# EAGLE design schematics (EAGLE 7.4.0)
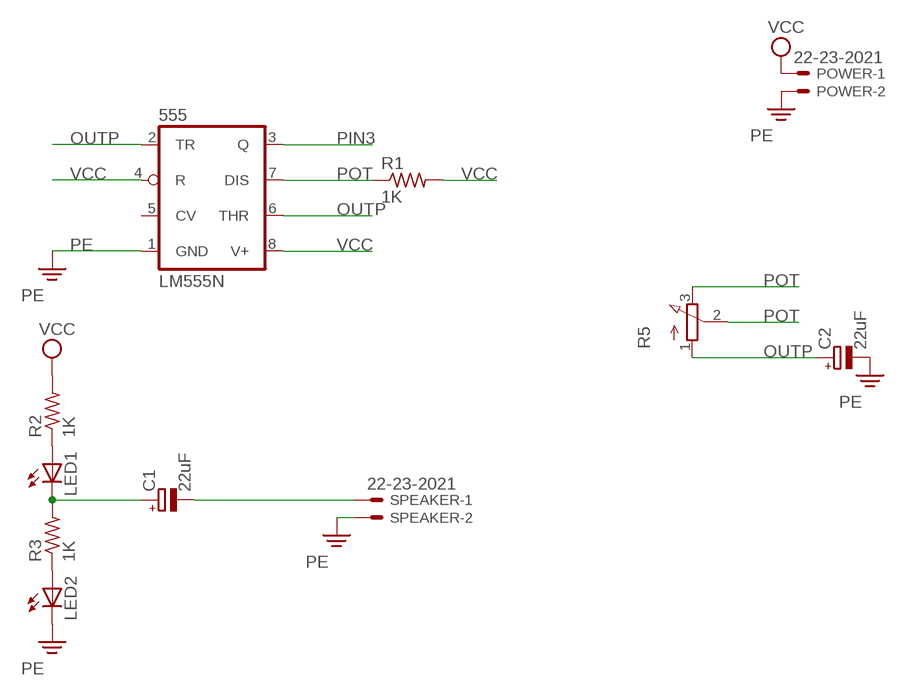
[diagram p0: schematic, sheet 1]

## Parts
555  LM555N  [DIL08]
C1  22uF  CPOL-EUE2.5-7  [E2,5-7]
C2  22uF  CPOL-EUE2.5-7  [E2,5-7]
LED1  LED5MM  [LED5MM]
LED2  LED5MM  [LED5MM]
POWER  22-23-2021  [22-23-2021]
R1  1K  R-US_0207/10  [0207/10]
R2  1K  R-US_0207/10  [0207/10]
R3  1K  R-US_0207/10  [0207/10]
R5  3RP/1610N  [3RP/1610N]
SPEAKER  22-23-2021  [22-23-2021]

## Nets
N$1: LED1.A R2.1
N$4: LED2.A R3.1
N$5: C1.- SPEAKER.1
OUTP: 555.2(TR) 555.6(THR) C2.+ R5.1(A)
PE: 555.1(GND) C2.- LED2.K(C) POWER.2 SPEAKER.2
PIN3: 555.3(Q) C1.+ LED1.K(C) R3.2
POT: 555.7(DIS) R1.1 R5.2(S) R5.3(E)
VCC: 555.4(R) 555.8(V+) POWER.1 R1.2 R2.2
Unconnected: 555.5(CV)

## Library data of the parts
555 = linear:*555: TIMER
C1 C2 = resistor:CPOL-EU: POLARIZED CAPACITOR, European symbol
LED1 LED2 = adafruit:LED: LED OSRAM: - CHIPLED LG R971, LG N971, LY N971, LG Q971, LY Q971, LO R971, LY R971 LH N974, LH R974 LS Q976, LO Q976, LY Q976 LO Q996 - Hyper CHIPLED LW Q18S LB Q993, LB Q99A, LB R99A - SideLED LS A670, LO A670, LY A670, LG A670, LP A670 LB A673, LV A673, LT A673, LW A673 LH A674 LY A675 LS A676, LA A676, LO A676, LY A676, LW A676 LS A679, LY A679, LG A679 - Hyper Micro SIDELED® LS Y876, LA Y876, LO Y876, LY Y876 LT Y87S - SmartLED LW L88C, LW L88S LB L89C, LB L89S, LG L890 LS L89K, LO L89K, LY L89K LS L896, LA L896, LO L896, LY L896 - TOPLED LS T670, LO T670, LY T670, LG T670, LP T670 LSG T670, LSP T670, LSY T670, LOP T670, LYG T670 LG T671, LOG T671, LSG T671 LB T673, LV T673, LT T673, LW T673 LH T674 LS T676, LA T676, LO T676, LY T676, LB T676, LH T676, LSB T676, LW T676 LB T67C, LV T67C, LT T67C, LS T67K, LO T67K, LY T67K, LW E67C LS E67B, LA E67B, LO E67B, LY E67B, LB E67C, LV E67C, LT E67C LW T67C LS T679, LY T679, LG T679 LS T770, LO T770, LY T770, LG T770, LP T770 LB T773, LV T773, LT T773, LW T773 LH T774 LS E675, LA E675, LY E675, LS T675 LS T776, LA T776, LO T776, LY T776, LB T776 LHGB T686 LT T68C, LB T68C - Hyper Mini TOPLED® LB M676 - Mini TOPLED Santana® LG M470 LS M47K, LO M47K, LY M47K Source: http://www.osram.convergy.de/
POWER SPEAKER = con-molex:22-23-2021: .100" (2.54mm) Center Header - 2 Pin; MF: MOLEX; MPN: 22-23-2021; OC_FARNELL: 1462926; OC_NEWARK: 25C3832
R1-R3 = adafruit:R-US_: RESISTOR, American symbol
R5 = pot:3RP/1610N: 16mm Potentiometer one level Source: http://www.alphapotentiometers.net/html/16mm_pot_2.html

## Board
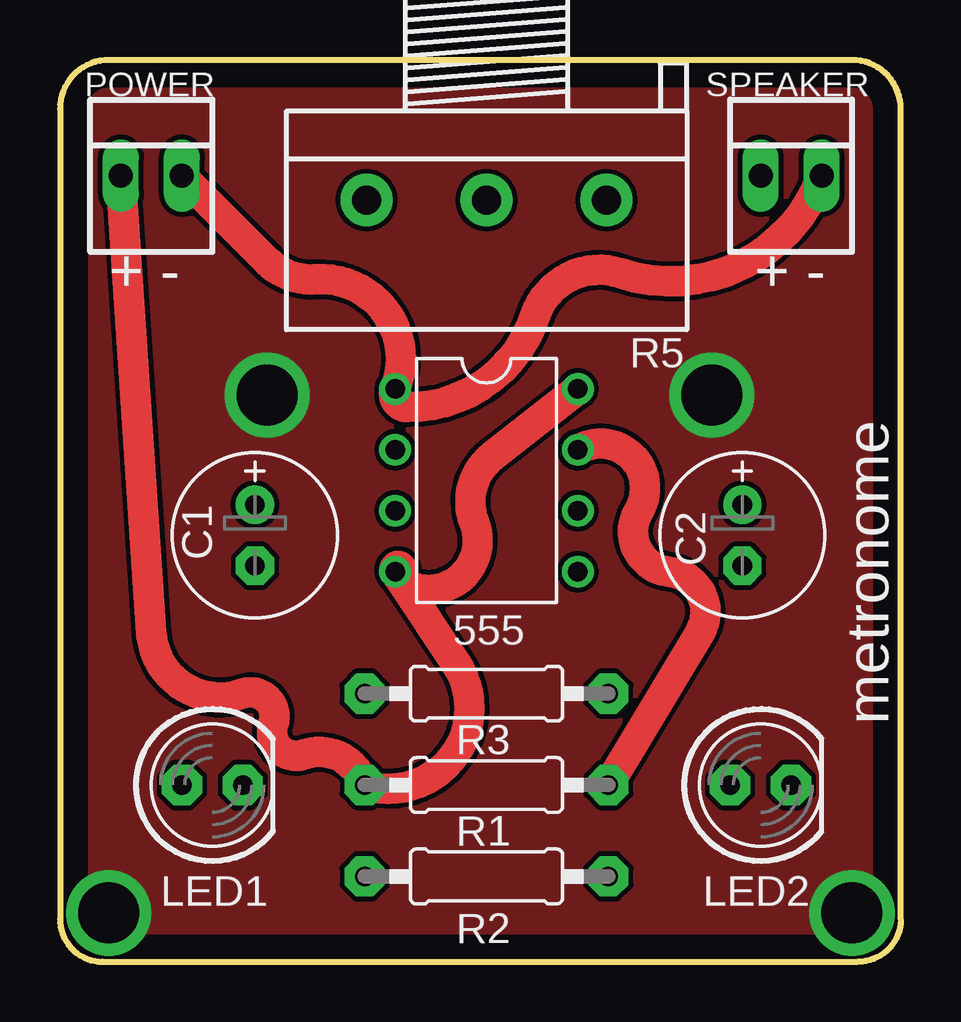
[diagram p1: board, top side]
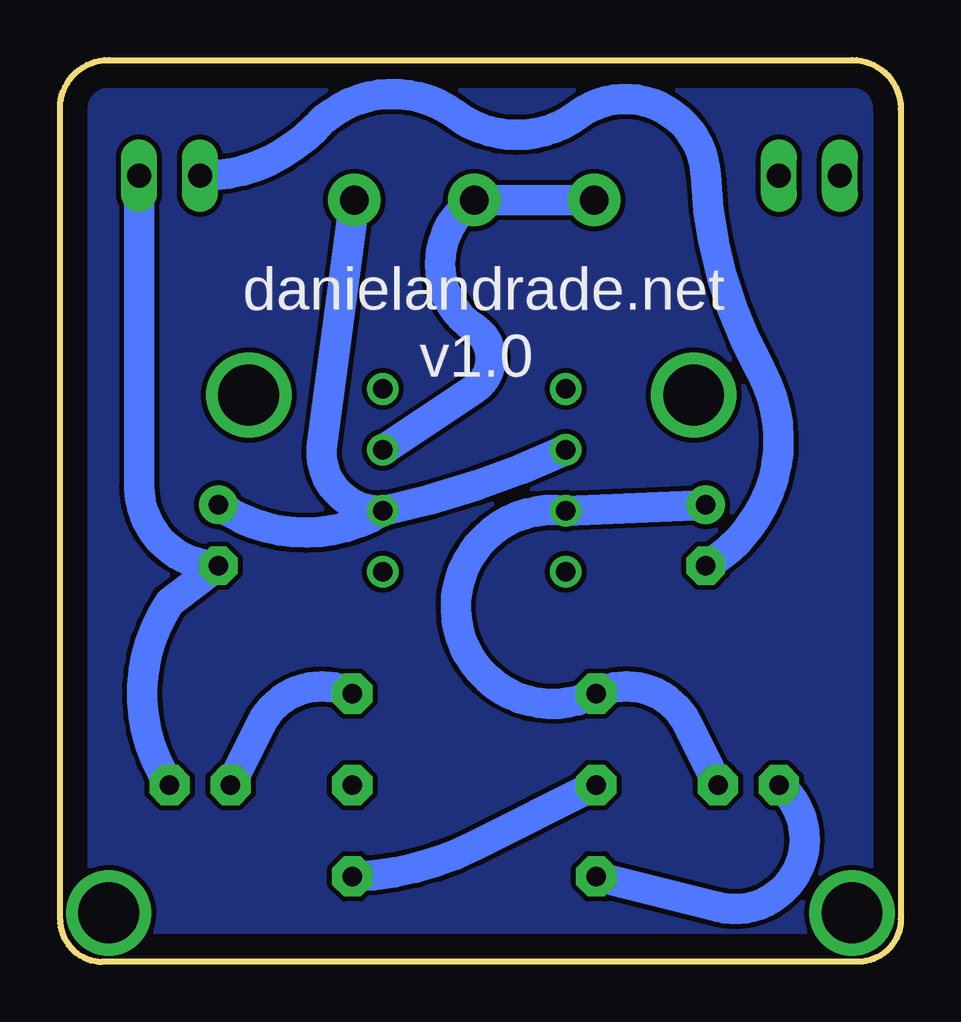
[diagram p2: board, bottom side, seen from below]

Size 35.05 x 37.59 mm. Coordinates in mm from the lower left corner, seen from the top.
Outline: 0,35.56 0,1.78 arc90 1.78,0 33.27,0 arc90 35.05,1.78 35.05,35.56 arc90 33.02,37.59 2.03,37.59 arc90 0,35.56
Copper layers (1*16): Top 0.035mm / dielectric 1.5mm / Bottom 0.035mm
Design rules "default": minimum track width 10mil, minimum drill 24mil, track to track 8mil, track to pad 8mil, pad to pad 8mil, via to via 8mil, smd to smd 8mil, copper to edge 40mil, drill to drill 8mil, minimum pad ring 10mil, minimum via ring 8mil, stop-mask expansion 4mil, vias tented up to drill 0mil, thermal gap 10mil

### Footprints (pad centres in the part's own frame; a part is rotated, then mirrored left to right if it is on the bottom)
DIL08 = drill 0.813 pad 1.27: 1 -3.81,-3.81; 2 -1.27,-3.81; 3 1.27,-3.81; 4 3.81,-3.81; 5 3.81,3.81; 6 1.27,3.81; 7 -1.27,3.81; 8 -3.81,3.81
E2,5-7 = drill 0.813 pad 1.6: + -1.27,0 | drill 0.813 pad 1.6 octagon: - 1.27,0
LED5MM = drill 0.813 pad 1.676 octagon: A -1.27,0; K 1.27,0
22-23-2021 = drill 1 long: 1 -1.27,0; 2 1.27,0
0207/10 = drill 0.813 pad 1.676 octagon: 1 -5.08,0; 2 5.08,0
3RP/1610N = drill 1.2 pad 2.184: 1 -5,0; 2 0,0; 3 5,0

### Placement (x,y rotation side)
555  17.78,20.07 270 top
C1  8.13,17.78 270 top
C2  28.45,17.78 270 top
LED1  6.35,7.37 0 top
LED2  29.21,7.37 0 top
POWER  3.81,32.77 0 top
R1  17.78,7.37 180 top
R2  17.78,3.56 0 top
R3  17.78,11.18 180 top
R5  17.78,31.75 180 top
SPEAKER  30.48,32.77 0 top

### Tracks (layer width: path | path; a pad name or v marks a point on that pad's centre or on a via)
GND  (via drill 2.54)
  other vias: 2.03,2.03 8.64,23.62 27.18,23.62 33.02,2.03
  pour Top: 0.25,36.07 0.25,2.03 arc90 2.03,0.25 33.27,0.25 arc90 34.8,1.78 34.8,35.56 arc90 33.02,37.34 2.03,37.34 1.52,37.34 arc90
N$1
  Bottom 1.27: R2.1 7.62,2.29 arc-155 LED1.A
N$2
  pour Bottom: 0.25,35.31 0.25,2.03 arc90 2.03,0.25 33.02,0.25 arc90 34.8,2.03 34.8,35.81 arc90 33.27,37.34 1.78,37.34 1.52,37.08 arc90 0.25,35.81
N$4
  Bottom 1.27: LED2.A 26.67,9.91 arc90 R3.1
N$5
  Bottom 1.27: SPEAKER.1 arc-47 24.38,34.8 arc83 18.54,35.31 arc-73 13.46,35.31 arc124 8.13,32.77 arc-26 5.84,24.64 arc89 C1.-
OUTP
  Bottom 1.27: C2.+ arc-67 555.6 | 555.6 arc-13 555.2 | R5.1 24.13,21.59 arc-100 555.6
PE
  Top 1.27: POWER.2 8.64,29.21 arc49 10.67,28.45 arc-116 555.1 arc112 14.48,23.11 arc72 19.81,26.92 arc-90 23.37,28.7 arc88 SPEAKER.2
  Bottom 1.27: LED2.K arc67 30.48,14.99 C2.- arc90 31.75,19.81 SPEAKER.2
PIN3
  Bottom 1.27: LED1.K 8.89,9.91 arc-90 R3.2 arc214 555.3 C1.+
POT
  Top 1.27: R1.1 26.67,13.72 arc115 25.4,16.26 arc-115 24.13,18.8 arc152 555.7
  Bottom 1.27: 555.7 17.78,23.88 arc-113 17.78,26.42 arc113 R5.2 R5.3
VCC
  Top 1.27: 14.24,15.85 555.4 arc-247 14.22,16.26 | 14.24,15.85 16.51,12.45 arc-141 R1.2 arc91 10.16,8.64 arc-128 8.89,9.91 arc128 7.62,11.18 arc-105 3.81,13.72 POWER.1 | 555.8 18.03,21.08 arc73 17.27,18.29 arc-145 14.24,15.85
  Bottom 1.27: R1.2 17.78,4.83 arc25 R2.2

### Text on the board
tPlace: + - | + - | metronome
bPlace: danielandrade.net | v1.0